# Altium schematic sheet 对射光电接收板-友商方案NPN-手抄版20260722.SchDoc
size A2
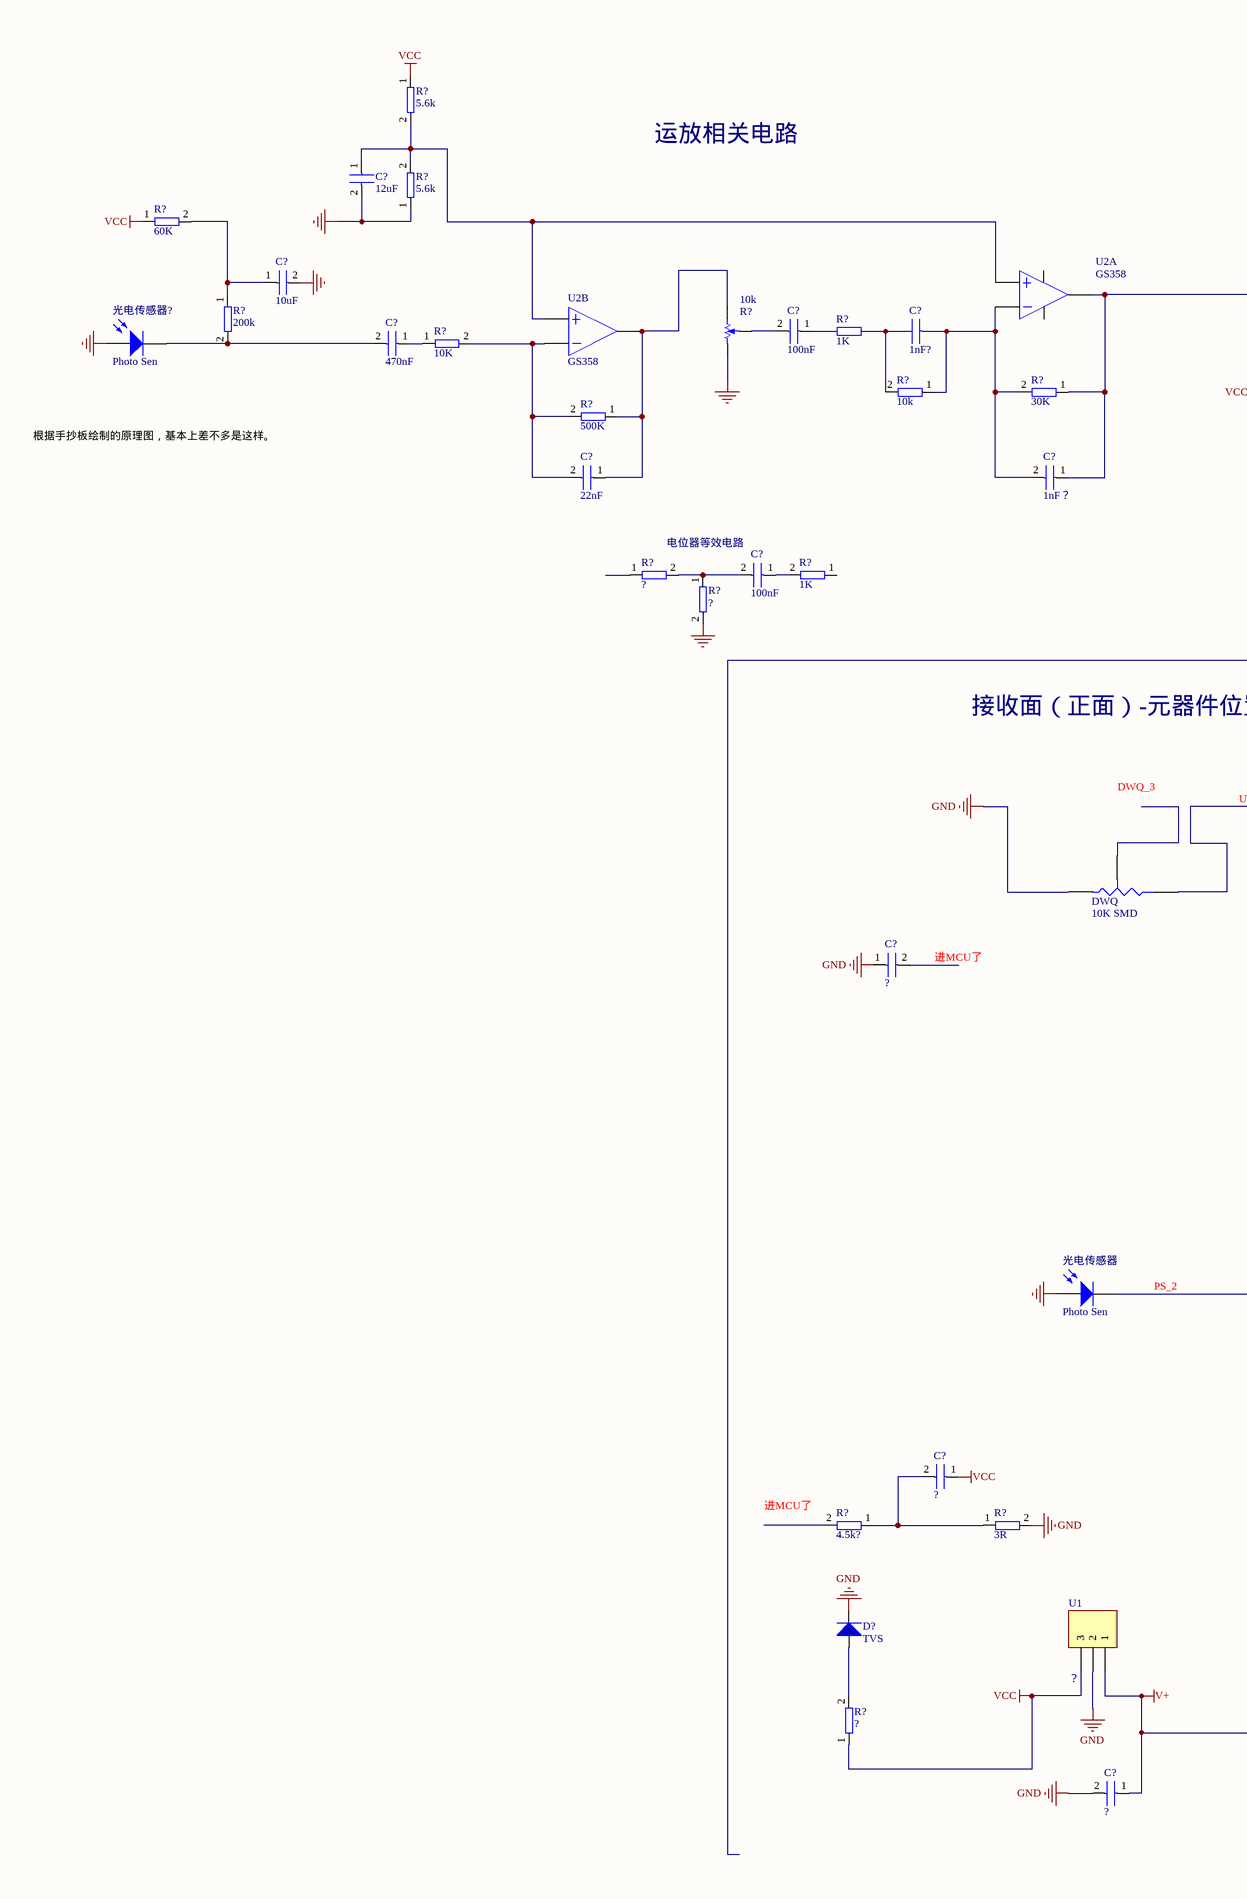
[diagram p0: 对射光电接收板-友商方案NPN-手抄版20260722.SchDoc, left]
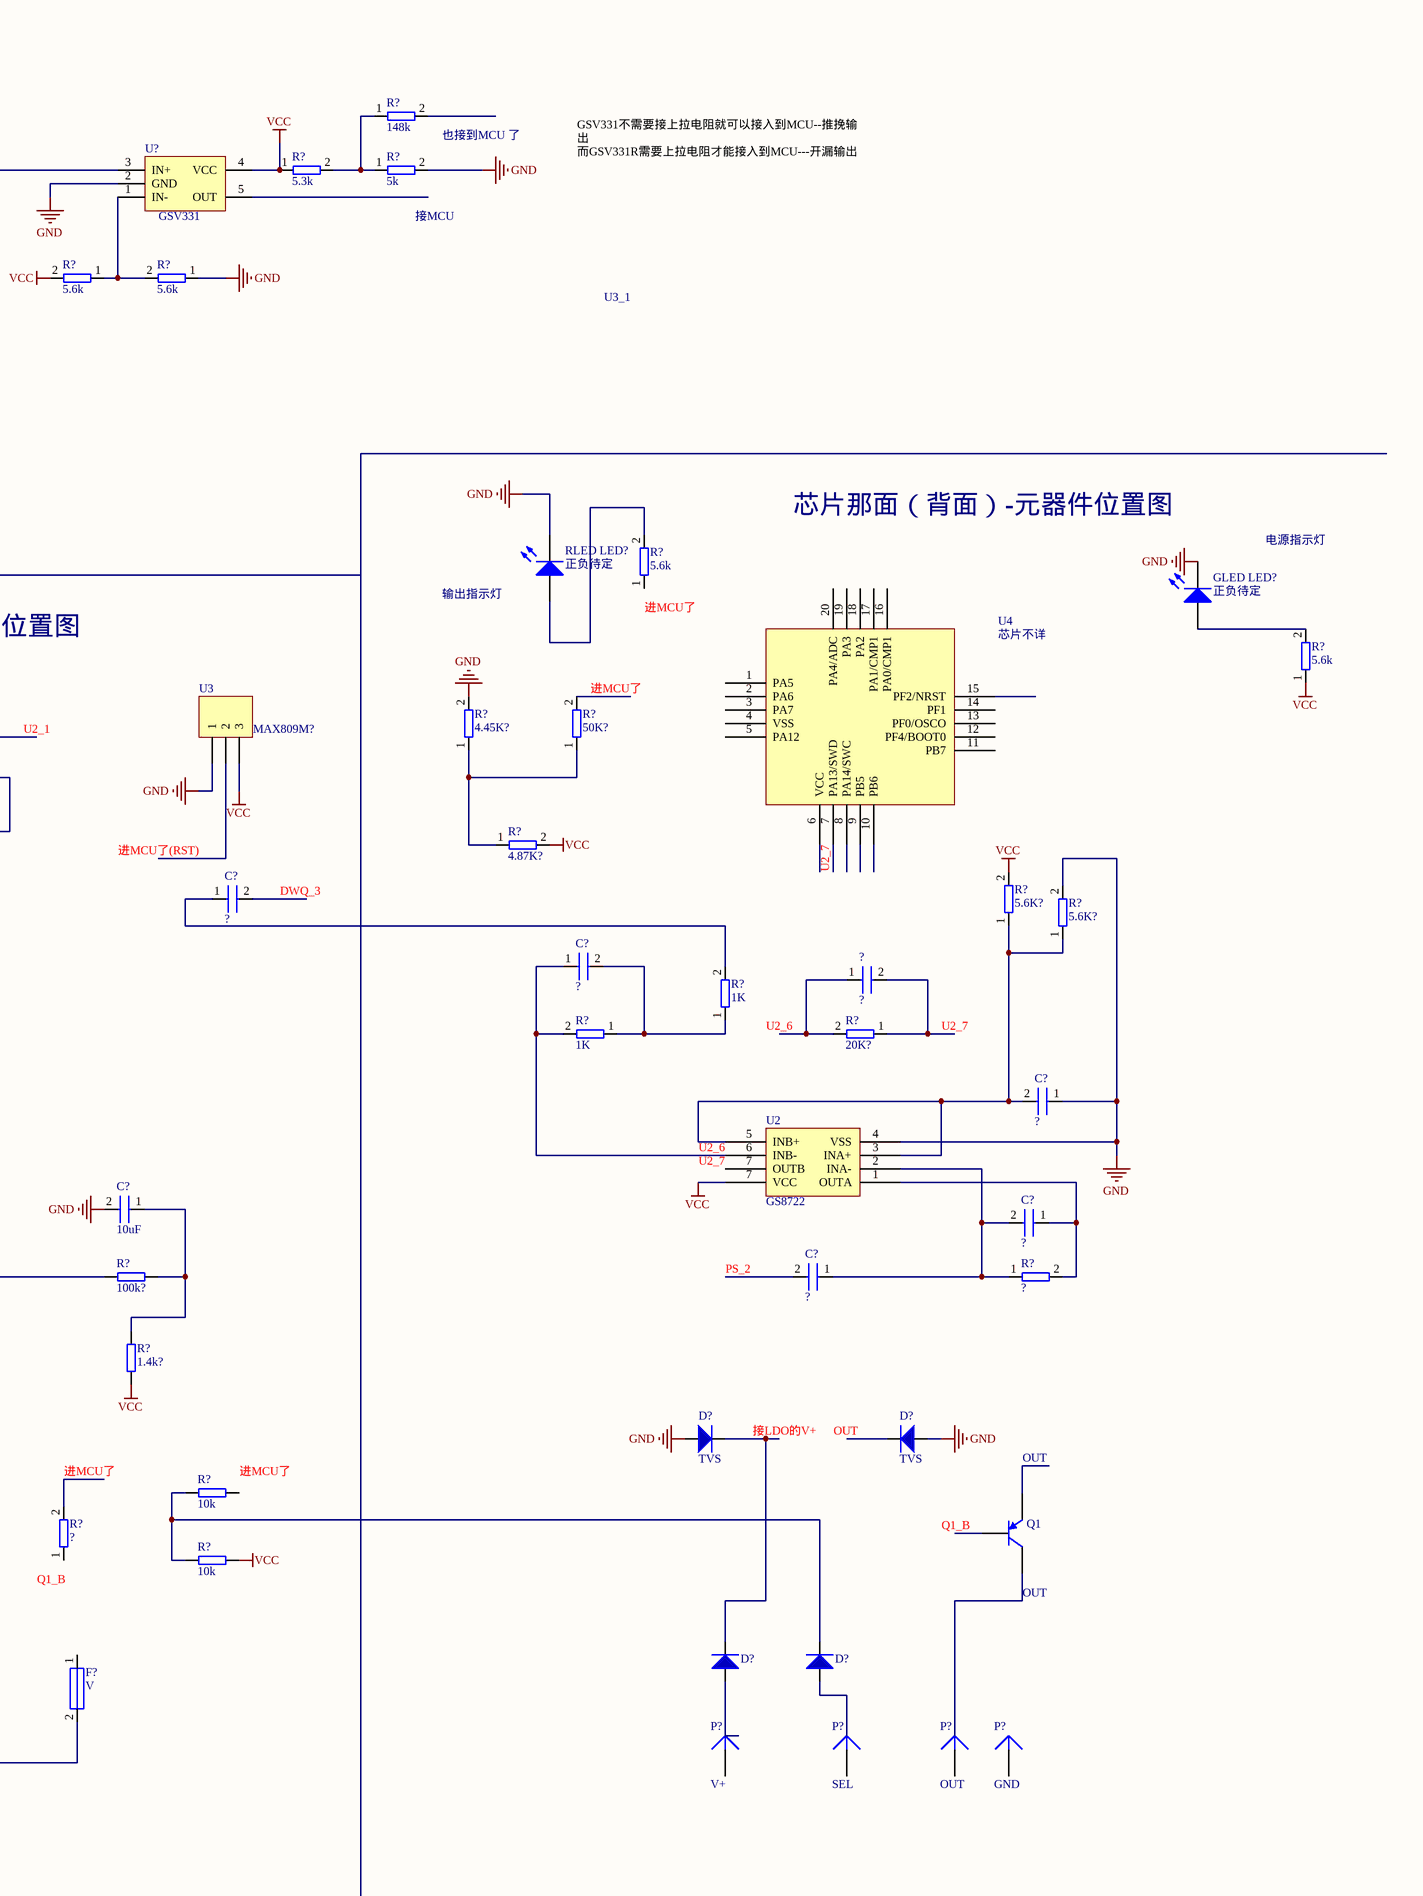
[diagram p1: 对射光电接收板-友商方案NPN-手抄版20260722.SchDoc, right]

## Parts
(Parts that share a designator on the sheet are numbered #1, #2 ... from top to bottom, then left to right.)
?  ?
C?#1  12uF
C?#2  10uF
C?#3  100nF
C?#4  1nF?
C?#5  470nF
C?#6  22nF
C?#7  1nF？
C?#8  100nF
C?#9  ?
C?#10  ?
C?#11  ?
C?#12  ?
C?#13  10uF
C?#14  ?
C?#15  ?
C?#16  ?
C?#17  ?
D?#1  TVS
D?#2  TVS
D?#3  TVS
D?#4  (no value)
D?#5  (no value)
DWQ  value 10K SMD  [VR3]  (hidden comment: Res Tap)
F?  V  [0805]
GLED_LED?  正负待定  [LED-0]
P?#1  V+  [PIN1]
P?#2  SEL  [PIN1]
P?#3  OUT  [PIN1]
P?#4  GND  [PIN1]
Q1  PNP  [SOT-23B_L]  (value not drawn)
R?#1  5.6k
R?#2  5.6k
R?#3  60K
R?#4  148k
R?#5  200k
R?#6  5.3k
R?#7  5k
R?#8  10k  [POT4MM-2]
R?#9  1K
R?#10  10K
R?#11  10k
R?#12  30K
R?#13  5.6k
R?#14  5.6k
R?#15  500K
R?#16  ?
R?#17  ?
R?#18  1K
R?#19  5.6k
R?#20  5.6k
R?#21  4.45K?
R?#22  50K?
R?#23  4.87K?
R?#24  5.6K?
R?#25  5.6K?
R?#26  1K
R?#27  1K
R?#28  20K?
R?#29  100k?
R?#30  ?
R?#31  1.4k?
R?#32  10k
R?#33  4.5k?
R?#34  3R
R?#35  ?
R?#36  10k
R?#37  ?
RLED_LED?  正负待定  [LED-0]
U1  ？  [HDR1X3]
U2#1  GS358  [SOP-8]  (parts A,B of 2)
U2#2  GS8722
U3  MAX809M?  [HDR1X3]
U4  芯片不详
U?  GSV331  [SC70]
光电传感器  Photo Sen  [PIN2]
光电传感器?  Photo Sen  [PIN2]

## Nets
GND: C?#1.2 C?#2.2 C?#10.1 C?#12.1 C?#13.2 C?#17.2 D?#1.1 D?#2.1 D?#3.2 DWQ.1(A) GLED_LED?.2(K) R?#2.1 R?#7.2 R?#8.CCW(-) R?#14.1 R?#17.2 R?#21.2 R?#25.2 R?#34.2 RLED_LED?.2(K) U1.2 U2#2.4(VSS) U3.1 U?.2(GND) 光电传感器.1(A) 光电传感器?.1(A)
V+: C?#17.1 F?.2 U1.1
VCC: C?#16.1 R?#1.1 R?#3.1 R?#6.1 R?#13.2 R?#20.1 R?#23.2 R?#24.2 R?#31.1 R?#36.2 R?#37.1 U1.3 U2#2.7(OUTB) U3.3 U?.4(VCC)
Net?_1: ?.1 R?#28.2
Net?_2: ?.2 R?#28.1
NetC?#1_1: C?#1.1 R?#1.2 R?#2.2 U2#1.3 U2#1.5
NetC?#2_1: C?#2.1 R?#3.2 R?#5.1
NetC?#3_2: C?#3.2 R?#8.W
NetC?#5_1: C?#5.1 R?#10.1
NetC?#5_2: C?#5.2 R?#5.2 光电传感器?.2(K)
NetC?#6_1: C?#6.1 R?#8.CW(+) R?#15.1 U2#1.7
NetC?#6_2: C?#6.2 R?#10.2 R?#15.2 U2#1.6
NetC?#7_1: C?#7.1 R?#12.1 U2#1.1 U?.3(IN+)
NetC?#7_2: C?#7.2 R?#11.1 R?#12.2 U2#1.2
NetC?#8_1: C?#8.1 R?#18.2
NetC?#8_2: C?#8.2 R?#16.2 R?#17.1
NetC?#9_1: C?#9.1 R?#26.2
NetC?#11_1: C?#11.1 R?#27.2 U2#2.6(INB-)
NetC?#11_2: C?#11.2 R?#26.1 R?#27.1
NetC?#12_2: C?#12.2 R?#24.1 R?#25.1 U2#2.3(INA+) U2#2.5(INB+)
NetC?#13_1: C?#13.1 R?#29.2 R?#31.2
NetC?#14_1: C?#14.1 R?#30.2 U2#2.1(OUTA)
NetC?#14_2: C?#14.2 C?#15.1 R?#30.1 U2#2.2(INA-)
NetC?#16_2: C?#16.2 R?#33.1 R?#34.1
NetD?#1_2: D?#1.2 D?#4.2
NetD?#3_1: D?#3.1 R?#37.2
NetD?#5_2: D?#5.2 R?#32.1 R?#36.1
NetGLED_LED?_1: GLED_LED?.1(A) R?#20.2
NetR?#4_1: R?#4.1 R?#6.2 R?#7.1
NetR?#13_1: R?#13.1 R?#14.2 U?.1(IN-)
NetR?#19_2: R?#19.2 RLED_LED?.1(A)
NetR?#21_1: R?#21.1 R?#22.1 R?#23.1
NetR?#29_1: R?#29.1 光电传感器.2(K)

Not connected (* = marked no-connect by the designer): C?#3 1; C?#4 1 2; C?#9 2; C?#10 2; C?#15 2; D?#2 2; D?#4 1; D?#5 1; DWQ 2(B) 3(TAP); F? 1; P?#1 1; P?#2 1; P?#3 1; P?#4 1; Q1 1(C) 2(B) 3(E); R?#4 2; R?#9 1 2; R?#11 2; R?#16 1; R?#18 1; R?#19 1; R?#22 2; R?#32 2; R?#33 2; R?#35 1 2; U2#1 4 8; U3 2; U4 1(PA5) 2(PA6) 3(PA7) 4(VSS) 5(PA12) 6(VCC) 7(PA13/SWD) 8(PA14/SWC) 9(PB5) 10(PB6) 11(PB7) 12(PF4/BOOT0) 13(PF0/OSCO) 14(PF1) 15(PF2/NRST) 16(PA0/CMP1) 17(PA1/CMP1) 18(PA2) 19(PA3) 20(PA4/ADC); U? 5(OUT)

## Notes on the sheet
- 运放相关电路
- (near R?#4) 也接到MCU 了
- (near R?#7) 接MCU
- GSV331不需要接上拉电阻就可以接入到MCU--推挽输出
  而GSV331R需要上拉电阻才能接入到MCU---开漏输出
- U3_1
- (near R?#16) 电位器等效电路
- 芯片那面（背面）-元器件位置图
- 根据手抄板绘制的原理图，基本上差不多是这样。
- 电源指示灯
- 接收面（正面）-元器件位置图
- 输出指示灯
- (near R?#19) 进MCU了
- DWQ_3
- (near R?#22) 进MCU了
- U2_1
- 进MCU了(RST)
- (near C?#10) 进MCU了
- (near C?#9) DWQ_3
- (near U4) U2_7
- (near R?#26) U2_6
- U2_7
- (near U2#2) U2_6
- (near U2#2) U2_7
- PS_2
- (near D?#1) 接LDO的V+
- (near D?#2) OUT
- OUT
- (near R?#33) 进MCU了
- (near R?#35) 进MCU了
- (near R?#32) 进MCU了
- (near Q1) Q1_B
- (near R?#35) Q1_B
- (near Q1) OUT

## Library data of the parts
? C?#1-C?#17 = CAP
D?#1-D?#5 = D
DWQ = Res Tap: Tapped Resistor; Sim Note: Enter the Resistance value and the set point into parameter fields.; Set Position: 0.5; Published: 24-Mar-1999; LatestRevisionDate: 17-Jul-2002; LatestRevisionNote: Re-released for DXP Platform.; PackageReference: VR3; Publisher: Altium Limited; PackageDescription: Variable Resistor, Thru-Hole; 3 Leads
F? = FUSE_0: Text Field1: 30; Text Field2: 20
GLED_LED? RLED_LED? = LED0: Typical INFRARED GaAs LED; Published: 8-Jun-2000; LatestRevisionDate: 08-Jul-2005; LatestRevisionNote: Mech Layer 1 removed.; PackageReference: LED-0; Publisher: Altium Limited; PackageDescription: LED; 2 Leads
P?#1-P?#4 = Plug: LatestRevisionDate: 17-Jul-2002; LatestRevisionNote: Re-released for DXP Platform.; Publisher: Altium Limited
Q1 = PNP: PNP Bipolar Transistor; Published: 8-Jun-2000; LatestRevisionDate: 29-May-2009; LatestRevisionNote: IPC-7351 Footprint Added.; PackageVersion: Aug-1999; PackageReference: SOT-23B; Publisher: Altium Limited; PackageDescription: 3-Pin SOT-23 Package 0.95 mm Pitch, 2.4 mm Lead Span
R?#1-R?#7 R?#9-R?#37 = RES
R?#8 = RPot SM: Square Trimming Potentiometer; Published: 17-Dec-2003; DatasheetVersion: Oct-2003; PackageReference: POT4MM-2; Publisher: Altium Limited; PackageDescription: Square Trimming Potentiometer; ComponentLink1Description: Manufacturer Link; ComponentLink1URL: http://bourns.com/2/search.html
U1 U3 = Header 3: Header, 3-Pin; LatestRevisionDate: 17-Jul-2002; LatestRevisionNote: Re-released for DXP Platform.; Publisher: Altium Limited
U2#1 = LM358
U2#2 = GS358
U4 = PY32F003F16U6
U? = C65
光电传感器 光电传感器? = Photo Sen: Photosensitive Diode; Published: 24-Mar-1999; LatestRevisionDate: 17-Jul-2002; LatestRevisionNote: Re-released for DXP Platform.; PackageReference: PIN2; Publisher: Altium Limited